# EAGLE design 40_FPC_BreakOut (EAGLE 5.11)
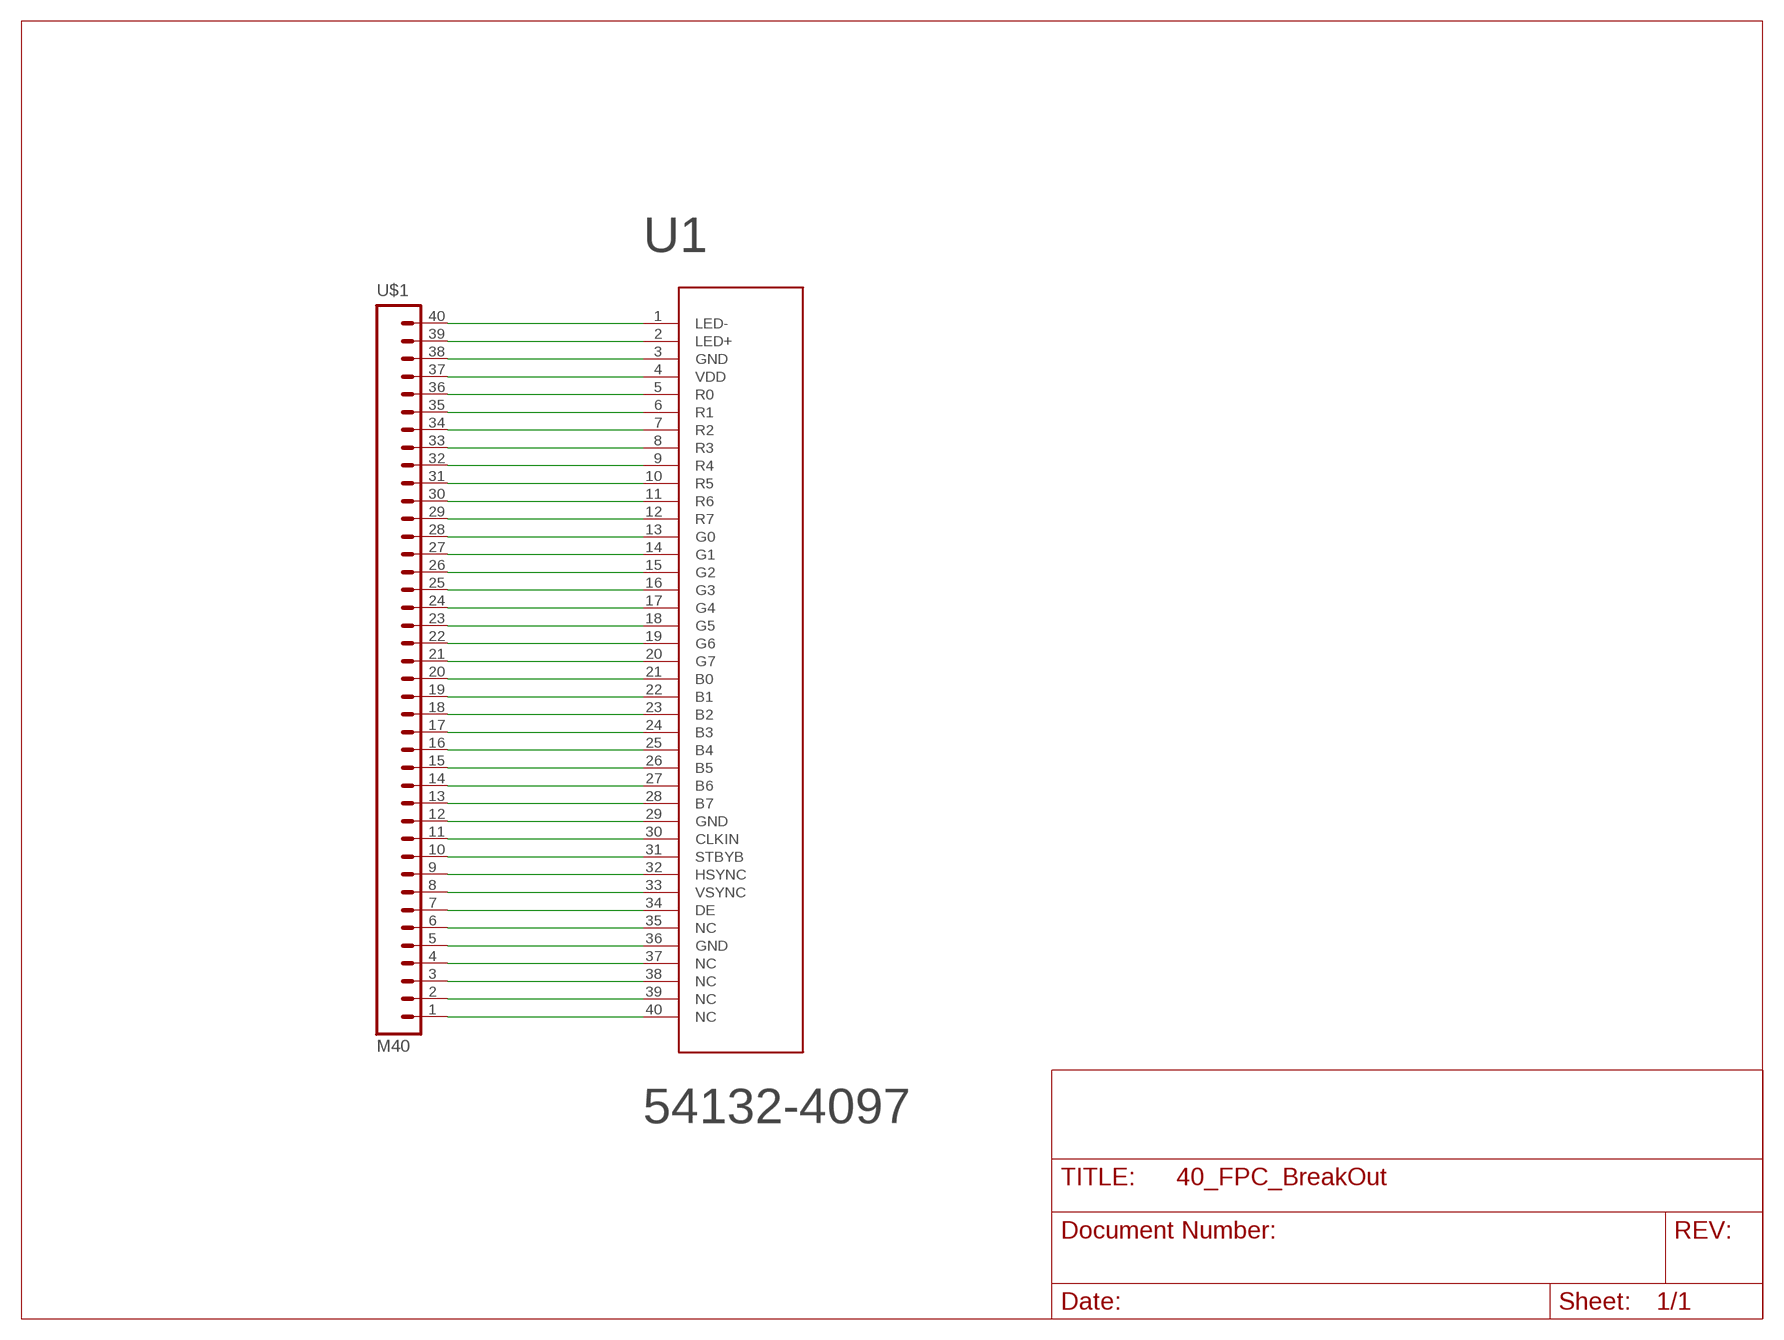
[diagram p0: schematic, sheet 1]

## Parts
U1  54132-4097  [MOLEX_40_FFC_FPC]
U$1  M40  [1X40]

## Nets
N$1: U1.40(NC) U$1.1
N$2: U1.39(NC) U$1.2
N$3: U1.38(NC) U$1.3
N$4: U1.37(NC) U$1.4
N$5: U1.36(GND) U$1.5
N$6: U1.35(NC) U$1.6
N$7: U1.34(DE) U$1.7
N$8: U1.33(VSYNC) U$1.8
N$9: U1.32(HSYNC) U$1.9
N$10: U1.31(STBYB) U$1.10
N$11: U1.30(CLKIN) U$1.11
N$12: U1.29(GND) U$1.12
N$13: U1.28(B7) U$1.13
N$14: U1.27(B6) U$1.14
N$15: U1.26(B5) U$1.15
N$16: U1.25(B4) U$1.16
N$17: U1.24(B3) U$1.17
N$18: U1.23(B2) U$1.18
N$19: U1.22(B1) U$1.19
N$20: U1.21(B0) U$1.20
N$21: U1.20(G7) U$1.21
N$22: U1.19(G6) U$1.22
N$23: U1.18(G5) U$1.23
N$24: U1.17(G4) U$1.24
N$25: U1.16(G3) U$1.25
N$26: U1.15(G2) U$1.26
N$27: U1.14(G1) U$1.27
N$28: U1.13(G0) U$1.28
N$29: U1.12(R7) U$1.29
N$30: U1.11(R6) U$1.30
N$31: U1.10(R5) U$1.31
N$32: U1.9(R4) U$1.32
N$33: U1.8(R3) U$1.33
N$34: U1.7(R2) U$1.34
N$35: U1.6(R1) U$1.35
N$36: U1.5(R0) U$1.36
N$37: U1.4(VDD) U$1.37
N$38: U1.3(GND) U$1.38
N$39: U1.2(LED+) U$1.39
N$40: U1.1(LED-) U$1.40

## Library data of the parts
U1 = beaglebone_components:54132-4097: MOLEX 40 PIN FPC
U$1 = SparkFun:M40

## Board
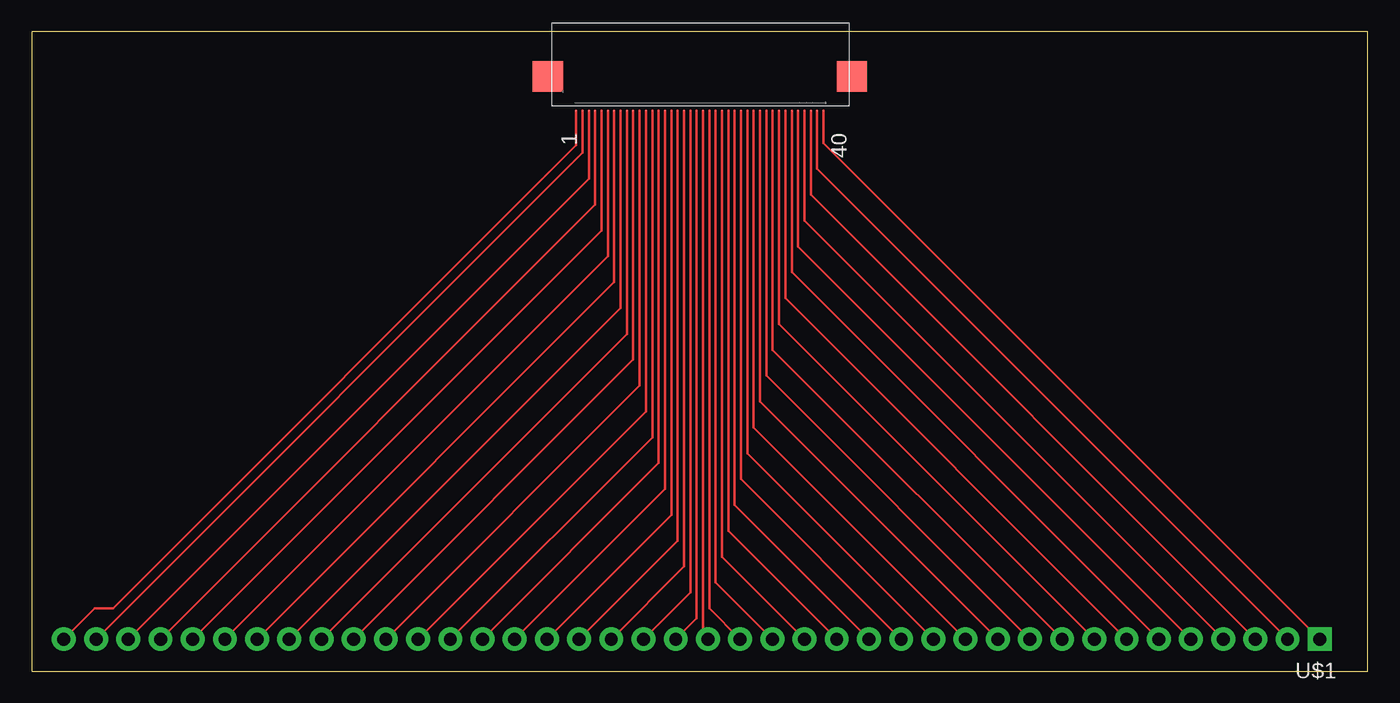
[diagram p1: board, top side]

Size 105.39 x 50.47 mm. Coordinates in mm from the lower left corner, seen from the top.
Outline: 0,0 105.39,0 105.39,50.47 0,50.47 0,0
Copper layers (1*16): Top 0.035mm / dielectric 1.5mm / Bottom 0.035mm
Design rules "default": minimum track width 10mil, minimum drill 24mil, track to track 8mil, track to pad 8mil, pad to pad 8mil, via to via 8mil, smd to smd 8mil, copper to edge 40mil, drill to drill 8mil, minimum pad ring 10mil, minimum via ring 8mil, stop-mask expansion 4mil, vias tented up to drill 0mil, thermal gap 10mil

### Footprints (pad centres in the part's own frame; a part is rotated, then mirrored left to right if it is on the bottom)
MOLEX_40_FFC_FPC = smd 0.076 x 0.076: 1 -4.04,9.12; 2 -4.04,8.62; 3 -4.04,8.12; 4 -4.04,7.62; 5 -4.04,7.12; 6 -4.04,6.62; 7 -4.04,6.12; 8 -4.04,5.62; 9 -4.04,5.12; 10 -4.04,4.62; 11 -4.04,4.12; 12 -4.04,3.62; 13 -4.04,3.12; 14 -4.04,2.62; 15 -4.04,2.12; 16 -4.04,1.62; 17 -4.04,1.12; 18 -4.04,0.62; 19 -4.04,0.12; 20 -4.04,-0.38; 21 -4.04,-0.88; 22 -4.04,-1.38; 23 -4.04,-1.88; 24 -4.04,-2.38; 25 -4.04,-2.88; 26 -4.04,-3.38; 27 -4.04,-3.88; 28 -4.04,-4.38; 29 -4.04,-4.88; 30 -4.04,-5.38; 31 -4.04,-5.88; 32 -4.04,-6.38; 33 -4.04,-6.88; 34 -4.04,-7.38; 35 -4.04,-7.88; 36 -4.04,-8.38; 37 -4.04,-8.88; 38 -4.04,-9.38; 39 -4.04,-9.88; 40 -4.04,-10.38 | smd 2.4 x 2.4: SOLDERED1 -1.34,-12.63; SOLDERED2 -1.34,11.37
1X40 = drill 1.016 pad 1.88 square: 1 -49.53,0 | drill 1.016 pad 1.88 round: 2 -46.99,0; 3 -44.45,0; 4 -41.91,0; 5 -39.37,0; 6 -36.83,0; 7 -34.29,0; 8 -31.75,0; 9 -29.21,0; 10 -26.67,0; 11 -24.13,0; 12 -21.59,0; 13 -19.05,0; 14 -16.51,0; 15 -13.97,0; 16 -11.43,0; 17 -8.89,0; 18 -6.35,0; 19 -3.81,0; 20 -1.27,0; 21 1.27,0; 22 3.81,0; 23 6.35,0; 24 8.89,0; 25 11.43,0; 26 13.97,0; 27 16.51,0; 28 19.05,0; 29 21.59,0; 30 24.13,0; 31 26.67,0; 32 29.21,0; 33 31.75,0; 34 34.29,0; 35 36.83,0; 36 39.37,0; 37 41.91,0; 38 44.45,0; 39 46.99,0; 40 49.53,0

### Placement (x,y rotation side)
U1  52.07,48.29 90 top
U$1  52.07,2.54 180 top

### Tracks (layer width: path | path; a pad name or v marks a point on that pad's centre or on a via)
N$1
  Top 0.178: U$1.1 62.45,41.69 U1.40
N$2
  Top 0.178: U1.39 61.95,39.65 U$1.2
N$3
  Top 0.178: U1.38 61.45,37.61 U$1.3
N$4
  Top 0.178: U1.37 60.95,35.57 U$1.4
N$5
  Top 0.178: U1.36 60.45,33.53 U$1.5
N$6
  Top 0.178: U1.35 59.95,31.49 U$1.6
N$7
  Top 0.178: U1.34 59.45,29.45 U$1.7
N$8
  Top 0.178: U1.33 58.95,27.41 U$1.8
N$9
  Top 0.178: U1.32 58.45,25.37 U$1.9
N$10
  Top 0.178: U1.31 57.95,23.33 U$1.10
N$11
  Top 0.178: U1.30 57.45,21.29 U$1.11
N$12
  Top 0.178: U1.29 56.95,19.25 U$1.12
N$13
  Top 0.178: U1.28 56.45,17.21 U$1.13
N$14
  Top 0.178: U1.27 55.95,15.17 U$1.14
N$15
  Top 0.178: U1.26 55.45,13.13 U$1.15
N$16
  Top 0.178: U1.25 54.95,11.09 U$1.16
N$17
  Top 0.178: U1.24 54.45,9.05 U$1.17
N$18
  Top 0.178: U1.23 53.95,7.01 U$1.18
N$19
  Top 0.178: U1.22 53.45,4.97 U$1.19
N$20
  Top 0.178: U1.21 52.95,2.93 U$1.20
N$21
  Top 0.178: U1.20 52.45,4.19 U$1.21
N$22
  Top 0.178: U1.19 51.95,6.23 U$1.22
N$23
  Top 0.178: U$1.23 51.45,8.27 U1.18
N$24
  Top 0.178: U$1.24 50.95,10.31 U1.17
N$25
  Top 0.178: U$1.25 50.45,12.35 U1.16
N$26
  Top 0.178: U$1.26 49.95,14.39 U1.15
N$27
  Top 0.178: U$1.27 49.45,16.43 U1.14
N$28
  Top 0.178: U$1.28 48.95,18.47 U1.13
N$29
  Top 0.178: U1.12 48.45,20.51 U$1.29
N$30
  Top 0.178: U$1.30 47.95,22.55 U1.11
N$31
  Top 0.178: U$1.31 47.45,24.59 U1.10
N$32
  Top 0.178: U$1.32 46.95,26.63 U1.9
N$33
  Top 0.178: U$1.33 46.45,28.67 U1.8
N$34
  Top 0.178: U1.7 45.95,30.71 U$1.34
N$35
  Top 0.178: U$1.35 45.45,32.75 U1.6
N$36
  Top 0.178: U$1.36 44.95,34.79 U1.5
N$37
  Top 0.178: U$1.37 44.45,36.83 U1.4
N$38
  Top 0.178: U$1.38 43.95,38.87 U1.3
N$39
  Top 0.178: U$1.39 43.45,40.91 U1.2
N$40
  Top 0.178: U1.1 42.95,41.5 6.43,4.98 4.98,4.98 U$1.40